# Altium schematic sheet 09_iMX 8X_SD CARD & V2X.SchDoc
size A3; SheetNumber: 10; SheetTotal: 24
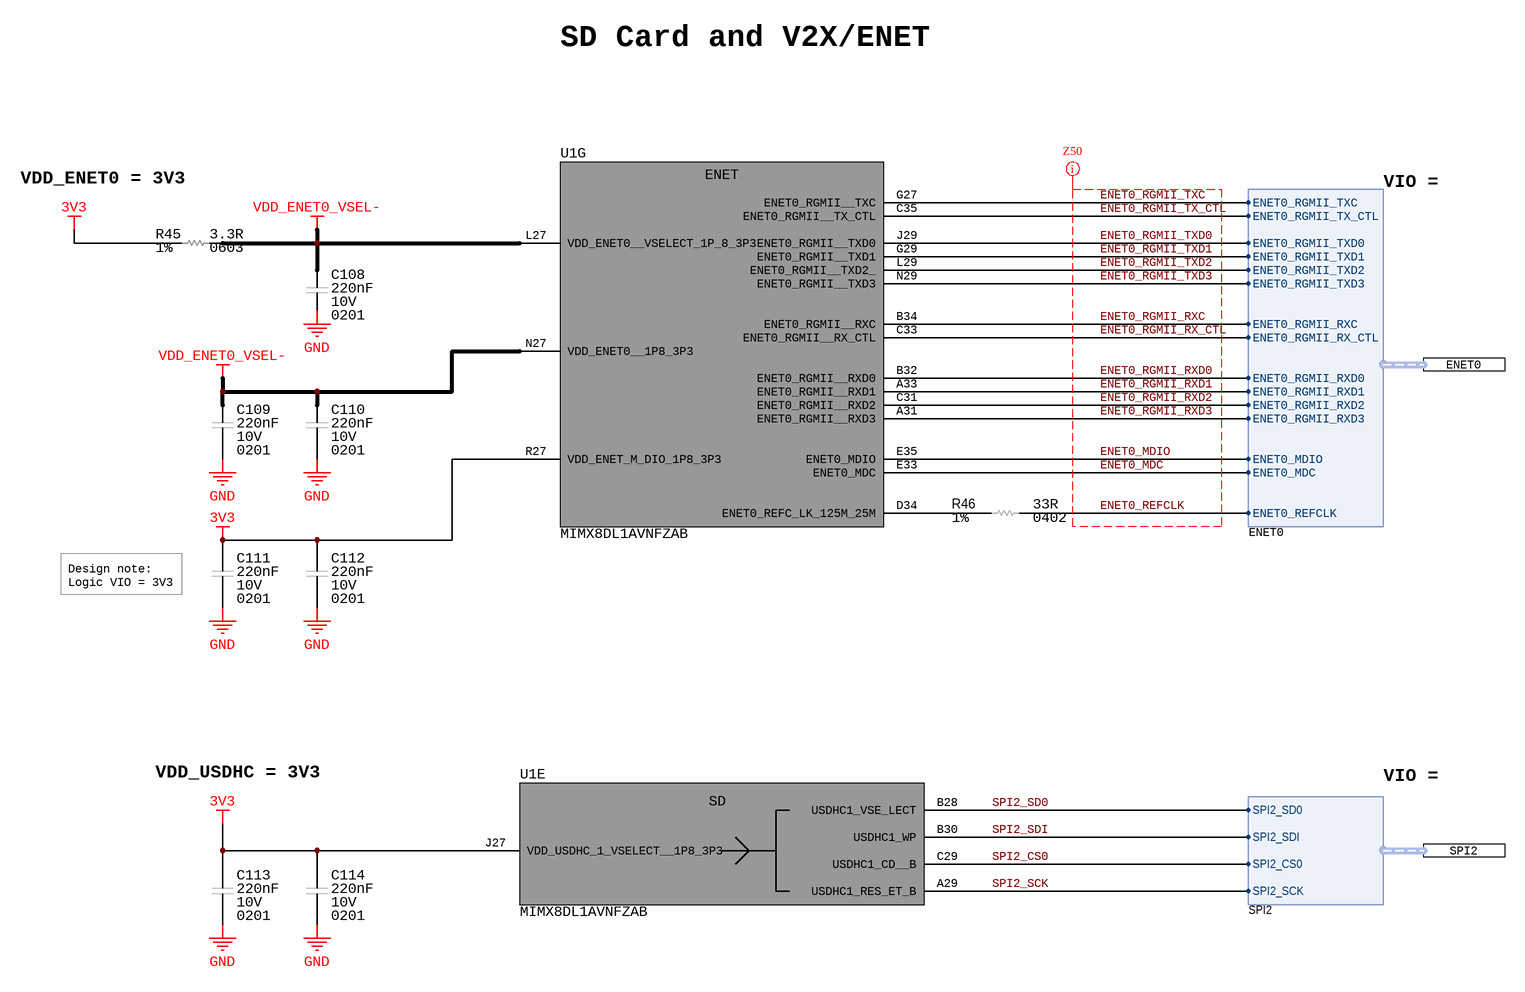
[diagram p0: 09_iMX 8X_SD CARD & V2X.SchDoc]

## Parts
C108  Voltage Rating (DC): 10V  Capacitance: 220nF  Case/Package: 0201  [CAP_0201_CAPC0603X03N]  (hidden comment: LMK063BJ224MP-F)
C109  Voltage Rating (DC): 10V  Capacitance: 220nF  Case/Package: 0201  [CAP_0201_CAPC0603X03N]  (hidden comment: LMK063BJ224MP-F)
C110  Voltage Rating (DC): 10V  Capacitance: 220nF  Case/Package: 0201  [CAP_0201_CAPC0603X03N]  (hidden comment: LMK063BJ224MP-F)
C111  Voltage Rating (DC): 10V  Capacitance: 220nF  Case/Package: 0201  [CAP_0201_CAPC0603X03N]  (hidden comment: LMK063BJ224MP-F)
C112  Voltage Rating (DC): 10V  Capacitance: 220nF  Case/Package: 0201  [CAP_0201_CAPC0603X03N]  (hidden comment: LMK063BJ224MP-F)
C113  Voltage Rating (DC): 10V  Capacitance: 220nF  Case/Package: 0201  [CAP_0201_CAPC0603X03N]  (hidden comment: LMK063BJ224MP-F)
C114  Voltage Rating (DC): 10V  Capacitance: 220nF  Case/Package: 0201  [CAP_0201_CAPC0603X03N]  (hidden comment: LMK063BJ224MP-F)
R45  Tolerance: 1%  Resistance: 3.3R  Case Code (Imperial): 0603  [RES_0603_RESC1608X04N]  (hidden comment: RK73H1JTTD3R30F)
R46  Tolerance: 1%  Resistance: 33R  Case/Package: 0402  [RES_0402_RESC1005X04N]  (hidden comment: RC0402FR-0733RL)
U1  MIMX8DL1AVNFZAB  [MIMX8DL1AVNFZAB]  (parts E,G of 15)

## Ports
ENET0 (harness ENET0), SPI2 (harness SPI2)

## Harnesses
ENET0: ENET0_RGMII_TXC, ENET0_RGMII_TX_CTL, ENET0_RGMII_TXD0, ENET0_RGMII_TXD1, ENET0_RGMII_TXD2, ENET0_RGMII_TXD3, ENET0_RGMII_RXC, ENET0_RGMII_RX_CTL, ENET0_RGMII_RXD0, ENET0_RGMII_RXD1, ENET0_RGMII_RXD2, ENET0_RGMII_RXD3, ENET0_MDIO, ENET0_MDC, ENET0_REFCLK
SPI2: SPI2_SD0, SPI2_SDI, SPI2_CS0, SPI2_SCK

## Nets
3V3: C111.2 C112.2 C113.2 C114.2 R45.1 U1.J27(VDD_USDHC_1_VSELECT__1P8_3P3) U1.R27(VDD_ENET_M_DIO_1P8_3P3)
GND: C108.1 C109.1 C110.1 C111.1 C112.1 C113.1 C114.1
VDD_ENET0_VSEL-: C108.2 C109.2 C110.2 R45.2 U1.L27(VDD_ENET0__VSELECT_1P_8_3P3) U1.N27(VDD_ENET0__1P8_3P3)
ENET0_MDC: U1.E33(ENET0_MDC) ; port ENET0.ENET0_MDC
ENET0_MDIO: U1.E35(ENET0_MDIO) ; port ENET0.ENET0_MDIO
ENET0_REFCLK: R46.2 ; port ENET0.ENET0_REFCLK
ENET0_RGMII_RX_CTL: U1.C33(ENET0_RGMII__RX_CTL) ; port ENET0.ENET0_RGMII_RX_CTL
ENET0_RGMII_RXC: U1.B34(ENET0_RGMII__RXC) ; port ENET0.ENET0_RGMII_RXC
ENET0_RGMII_RXD0: U1.B32(ENET0_RGMII__RXD0) ; port ENET0.ENET0_RGMII_RXD0
ENET0_RGMII_RXD1: U1.A33(ENET0_RGMII__RXD1) ; port ENET0.ENET0_RGMII_RXD1
ENET0_RGMII_RXD2: U1.C31(ENET0_RGMII__RXD2) ; port ENET0.ENET0_RGMII_RXD2
ENET0_RGMII_RXD3: U1.A31(ENET0_RGMII__RXD3) ; port ENET0.ENET0_RGMII_RXD3
ENET0_RGMII_TX_CTL: U1.C35(ENET0_RGMII__TX_CTL) ; port ENET0.ENET0_RGMII_TX_CTL
ENET0_RGMII_TXC: U1.G27(ENET0_RGMII__TXC) ; port ENET0.ENET0_RGMII_TXC
ENET0_RGMII_TXD0: U1.J29(ENET0_RGMII__TXD0) ; port ENET0.ENET0_RGMII_TXD0
ENET0_RGMII_TXD1: U1.G29(ENET0_RGMII__TXD1) ; port ENET0.ENET0_RGMII_TXD1
ENET0_RGMII_TXD2: U1.L29(ENET0_RGMII__TXD2_) ; port ENET0.ENET0_RGMII_TXD2
ENET0_RGMII_TXD3: U1.N29(ENET0_RGMII__TXD3) ; port ENET0.ENET0_RGMII_TXD3
SPI2_CS0: U1.C29(USDHC1_CD__B) ; port SPI2.SPI2_CS0
SPI2_SCK: U1.A29(USDHC1_RES_ET_B) ; port SPI2.SPI2_SCK
SPI2_SD0: U1.B28(USDHC1_VSE_LECT) ; port SPI2.SPI2_SD0
SPI2_SDI: U1.B30(USDHC1_WP) ; port SPI2.SPI2_SDI
NetR46_1: R46.1 U1.D34(ENET0_REFC_LK_125M_25M)

## Layout directives
net class Z50: ENET0_MDC, ENET0_MDIO, ENET0_REFCLK, ENET0_RGMII_RX_CTL, ENET0_RGMII_RXC, ENET0_RGMII_RXD0, ENET0_RGMII_RXD1, ENET0_RGMII_RXD2, ENET0_RGMII_RXD3, ENET0_RGMII_TX_CTL, ENET0_RGMII_TXC, ENET0_RGMII_TXD0, ENET0_RGMII_TXD1, ENET0_RGMII_TXD2, ENET0_RGMII_TXD3

## Notes on the sheet
- SD Card and V2X/ENET
- VDD_ENET0 = 3V3
- VIO = 3V3
- (near C111) Design note:
  Logic VIO = 3V3
- VDD_USDHC = 3V3
- PCB Des :
- Approv By :
- Project Title :
- Sheet Title :
- Date :
- PCB Version :
- Size :
- A3
- Page :
- PCB Revision :
- (in symbol IC_MPU_ARM_1.2GHz_MIMX8DL1AVNFZAB, part E) SD
- (in symbol IC_MPU_ARM_1.2GHz_MIMX8DL1AVNFZAB, part G) ENET

## Library data of the parts
C108-C114 = CAP_0.22UF_10V_X5R_0201: Multilayer Ceramic Capacitors (High dielectric type), 10V, 0.22 uF, ± 20 %, 0201, X5R, RoHS; Manufacturer: Taiyo Yuden; Material: 4241ConductorMaterial; Tolerance: 20%; Supplier 1: Digikey; Manufacturer Part Number: LMK063BJ224MP-F; RoHS: Yes; Category: Ceramic Capacitors; Stock 1: 6053224; Pricing 1: 1=0.12, 10=0.08, 50=0.0478, 100=0.0375, 500=0.02772, 1000=0.02295, 2500=0.02136, 5000=0.01954 (USD); Mount: Surface Mount; Case Code (Metric): 0603; Case Code (Imperial): 0201; Min Operating Temperature: -55°C; Max Operating Temperature: 85°C; Voltage Rating: 10V; Packaging: Tape and Reel; Package Quantity: 15000; Dielectric: X5R; Termination: SMD/SMT; Voltage: 10V; Series: M; Construction: Flat; Length: 0.6mm; Width: 0.3mm; Height: 0.3mm; Depth: 0.3mm; Radiation Hardening: No; Halogen Free: Halogen Free; RoHS Compliant: Yes; Reach SVHC Compliant: Unknown; ComponentLink1URL: https://datasheet.ciiva.com/134/lmk063bj224mp-f-ss-134995.pdf?src-supplier=Digikey; ComponentLink1Description: https://datasheet.ciiva.com/134/lmk063bj224mp-f-ss-134995.pdf?src-supplier=Digikey; ComponentLink2URL: https://datasheet.ciiva.com/11464/lmk063bj224mp-f-ss-11464053.pdf?src-supplier=Avnet; ComponentLink2Description: https://datasheet.ciiva.com/11464/lmk063bj224mp-f-ss-11464053.pdf?src-supplier=Avnet; ComponentLink3URL: https://datasheet.ciiva.com/15921/1589lmk063bj224mp-f-15921250.pdf?src-supplier=Onlinecomponents.com; ComponentLink3Description: https://datasheet.ciiva.com/15921/1589lmk063bj224mp-f-15921250.pdf?src-supplier=Onlinecomponents.com; ComponentLink4URL: https://datasheet.ciiva.com/26872/getdatasheetpartid-639019-26872592.pdf?src-supplier=Verical; ComponentLink4Description: https://datasheet.ciiva.com/26872/getdatasheetpartid-639019-26872592.pdf?src-supplier=Verical; ComponentLink5URL: https://datasheet.ciiva.com/30243/100lmk063bj224mp-f-30243150.pdf?src-supplier=Onlinecomponents.com; ComponentLink5Description: https://datasheet.ciiva.com/30243/100lmk063bj224mp-f-30243150.pdf?src-supplier=Onlinecomponents.com; ComponentLink6URL: https://datasheet.ciiva.com/28645/746258-28645141.pdf?src-supplier=Element14; ComponentLink6Description: https://datasheet.ciiva.com/28645/746258-28645141.pdf?src-supplier=Element14; ComponentLink7URL: https://datasheet.ciiva.com/5422/mlcc-all-e-541559-5422365.pdf?src-supplier=Mouser; ComponentLink7Description: https://datasheet.ciiva.com/5422/mlcc-all-e-541559-5422365.pdf?src-supplier=Mouser; Supplier Part Number 1: 587-2483-1-ND
R45 = RES_3.3R_1%_125mW_0603: Thick Film Chip Resistor 0603 SMD 3.3 Ohm 1% 0.125W(1/8W) 200ppm/C; Manufacturer: KOA Speer; Voltage Rating: 50V; Power Rating: 100mW; Temperature Coefficient: 200ppm/°C; Max Power Dissipation: 125mW; Supplier 1: Digikey; Manufacturer Part Number: RK73H1JTTD3R30F; RoHS: Yes; Category: Chip SMD Resistors; Stock 1: 68759; Pricing 1: 1=0.1, 10=0.023, 50=0.0146, 100=0.0122, 500=0.00832, 1000=0.00717 (USD); Case/Package: 0603; Number of Pins: 2; Case Code (Metric): 1608; Min Operating Temperature: -55°C; Max Operating Temperature: 155°C; Packaging: Tape and Reel; Resistor Type: Thick Film; Termination: SMD/SMT; Series: RK73H; Construction: Rectangular; Resistance Tolerance: 1%; Features: Moisture Resistant,Automotive AEC-Q200; Number of Terminations: 2; Length: 1.6mm; Depth: 0.8mm; Ratings: AEC-Q200; Military Standard: Not; Lead Free: Lead Free; RoHS Compliant: Yes; ComponentLink1URL: https://datasheet.ciiva.com/5556/rk73h-5556827.pdf?src-supplier=Mouser; ComponentLink1Description: https://datasheet.ciiva.com/5556/rk73h-5556827.pdf?src-supplier=Mouser; ComponentLink2URL: https://datasheet.ciiva.com/48426/rk73h-series-eng-jap-tds-48426603.pdf?src-supplier=Distrelec; ComponentLink2Description: https://datasheet.ciiva.com/48426/rk73h-series-eng-jap-tds-48426603.pdf?src-supplier=Distrelec; ComponentLink3URL: https://datasheet.ciiva.com/7816/549017-7816815.pdf?src-supplier=Element14; ComponentLink3Description: https://datasheet.ciiva.com/7816/549017-7816815.pdf?src-supplier=Element14; Supplier Part Number 1: 2019-RK73H1JTTD3R30FCT-ND
R46 = RES_33R_1%_62.5mW_0402: SMD Chip Resistor, 33 Ohm, ± 1%, 62.5 mW, 0402 [1005 Metric], Thick Film, General Purpose; Manufacturer: Yageo; Power Rating: 62.5mW; Voltage Rating: 50V; Temperature Coefficient: 100ppm/°C; Max Power Dissipation: 63mW; Supplier 1: Digikey; Manufacturer Part Number: RC0402FR-0733RL; RoHS: Yes; Category: Chip SMD Resistors; Stock 1: 4637808; Pricing 1: 1=0.1, 10=0.015, 50=0.0088, 100=0.0073, 500=0.00488, 1000=0.00417, 5000=0.00297, 10000=0.00261, 20000=0.00231, 30000=0.00216, 50000=0.00199, 100000=0.00179 (USD); Number of Pins: 2; Case Code (Imperial): 0402; Case Code (Metric): 1005; Size Code: 0402; Min Operating Temperature: -55°C; Max Operating Temperature: 155°C; Packaging: Tape and Reel; Voltage Rating (DC): 50V; Package Quantity: 10000; Termination: SMD/SMT; Resistor Type: Thick Film; Features: Moisture Resistant; Series: RC; Number of Terminations: 2; Resistance Tolerance: 1%; Construction: Rectangular; Technology: THICK FILM; Voltage Rating (AC): 50V; Length: 1mm; Width: 0.5mm; Height: 0.35mm; Depth: 0.5mm; Military Standard: Not; Lead Free: Lead Free; RoHS Compliant: Yes; Reach SVHC Compliant: Unknown; ComponentLink1URL: https://datasheet.ciiva.com/11819/0900766b80c66297-11819487.pdf?src-supplier=Rs; ComponentLink1Description: https://datasheet.ciiva.com/11819/0900766b80c66297-11819487.pdf?src-supplier=Rs; ComponentLink2URL: https://datasheet.ciiva.com/7849/1018594-7849966.pdf?src-supplier=Element14; ComponentLink2Description: https://datasheet.ciiva.com/7849/1018594-7849966.pdf?src-supplier=Element14; ComponentLink3URL: https://datasheet.ciiva.com/7849/1018594-7849967.pdf?src-supplier=Element14; ComponentLink3Description: https://datasheet.ciiva.com/7849/1018594-7849967.pdf?src-supplier=Element14; ComponentLink4URL: https://datasheet.ciiva.com/24070/pyu-rc0402-51-rohs-l-6-r-8721-24070077.pdf?src-supplier=Mouser; ComponentLink4Description: https://datasheet.ciiva.com/24070/pyu-rc0402-51-rohs-l-6-r-8721-24070077.pdf?src-supplier=Mouser; Supplier Part Number 1: 311-33.0LRCT-ND
U1 = IC_MPU_ARM_1.2GHz_MIMX8DL1AVNFZAB: I.MX8 Dxl 15SQ / Tray Rohs Compliant: Yes; Manufacturer: NXP Semiconductors; Supplier 1: Mouser; Manufacturer Part Number: MIMX8DL1AVNFZAB; RoHS: No; Category: Uncategorized; Stock 1: 196; Pricing 1: 1=46.19, 10=40.26, 25=38.57, 50=38.56, 100=33.3, 252=33.16, 1000=33.3, 10000=33.3 (USD); Supplier Part Number 1: 771-MIMX8DL1AVNFZAB